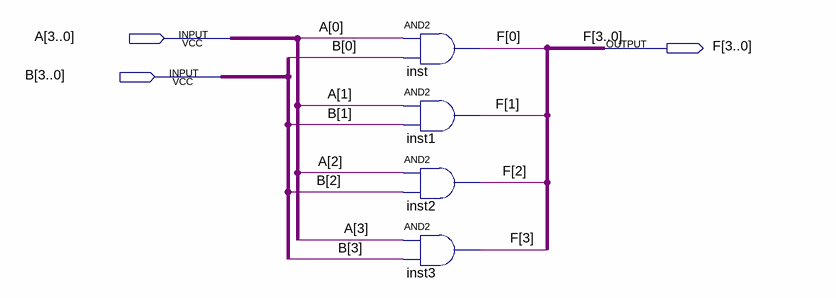
[diagram p0: schematic sheet]
// Quartus schematic 4b_and.bdf as structural Verilog: 4 symbols, 3 pins
module \4b_and  (
  input  [3:0] A,
  input  [3:0] B,
  output [3:0] F
);

  and inst (F[0], A[0], B[0]);
  and inst1 (F[1], A[1], B[1]);
  and inst2 (F[2], A[2], B[2]);
  and inst3 (F[3], A[3], B[3]);
endmodule
